# Altium schematic sheet PCB_Guardian.SchDoc
size A4
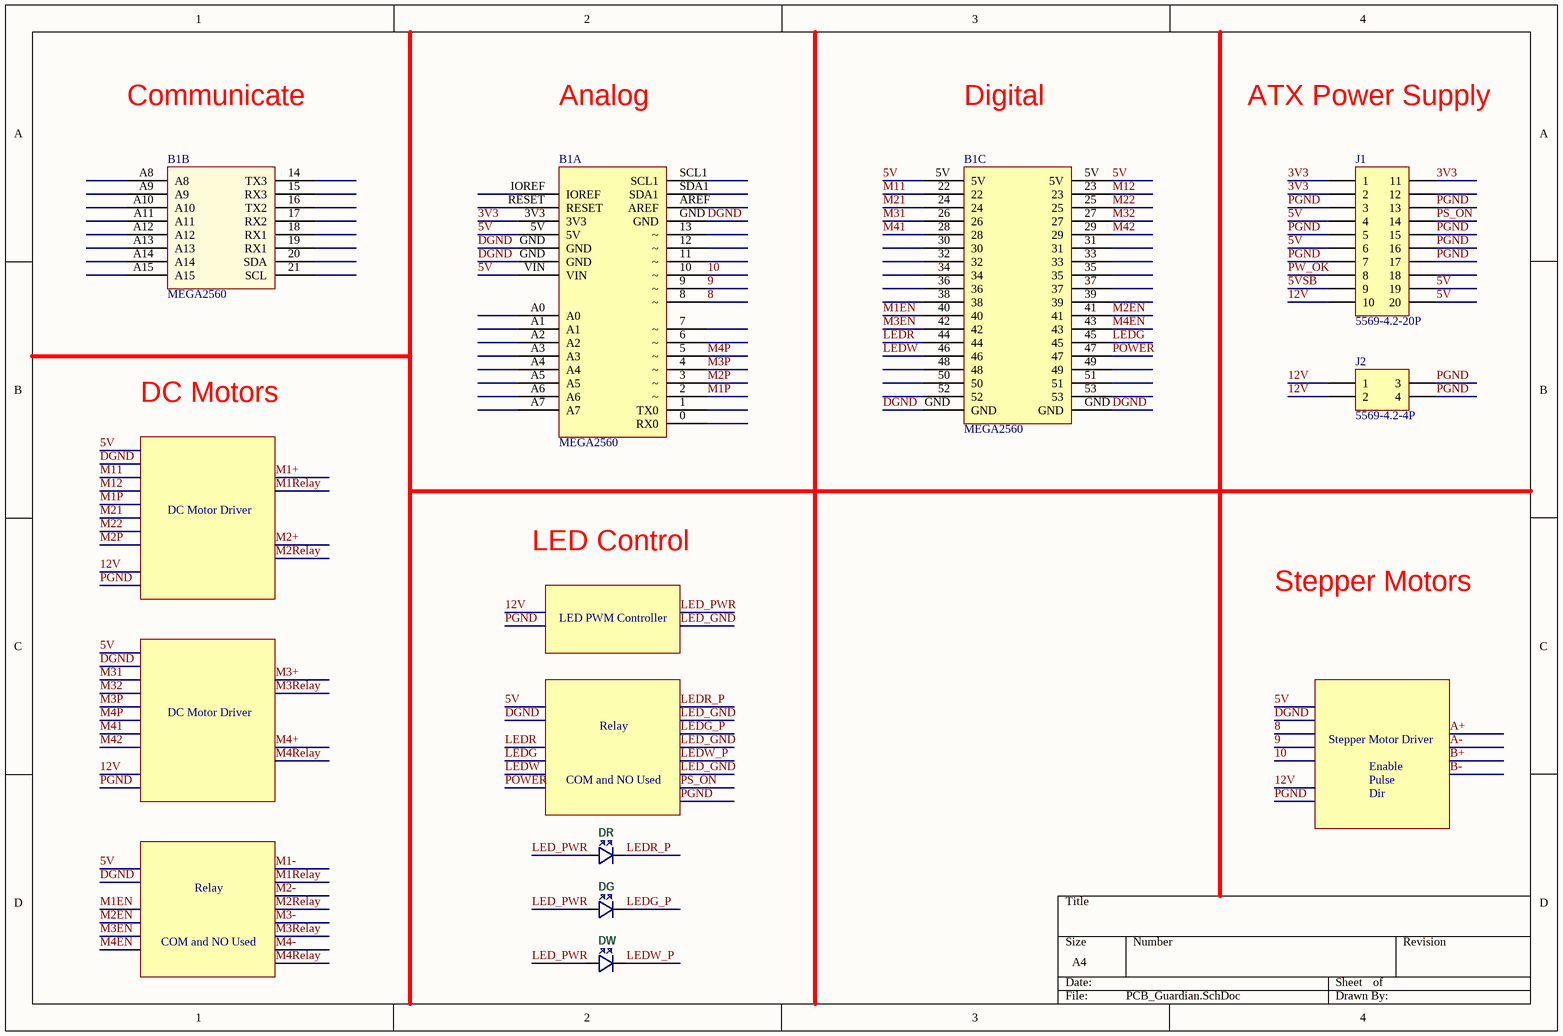
[diagram p0: PCB_Guardian.SchDoc]

## Parts
B1  MEGA2560  [Arduino MEGA2560 Center Mount Holes]  (parts A,B,C of 3)
DG  (no value)
DR  (no value)
DW  (no value)
J1  5569-4.2-20P  [5569_2*10P_CEN_H_4.2]
J2  5569-4.2-4P  [5569_2*2P_CEN_H_4.2]

## Nets
3V3: B1.3V3 J1.1 J1.2 J1.11
5V: B1.5V B1.VIN J1.4 J1.6 J1.19 J1.20
5VSB: J1.9
8: B1.8
9: B1.9
10: B1.10
12V: J1.10 J2.1 J2.2
DGND: B1.GND
LED_PWR: DG.A DR.A DW.A
LEDG: B1.45
LEDG_P: DG.K
LEDR: B1.44
LEDR_P: DR.K
LEDW: B1.46
LEDW_P: DW.K
M1EN: B1.40
M1P: B1.2
M2EN: B1.41
M2P: B1.3
M3EN: B1.42
M3P: B1.4
M4EN: B1.43
M4P: B1.5
M11: B1.22
M12: B1.23
M21: B1.24
M22: B1.25
M31: B1.26
M32: B1.27
M41: B1.28
M42: B1.29
PGND: J1.3 J1.5 J1.7 J1.13 J1.15 J1.16 J1.17 J2.3 J2.4
POWER: B1.47
PS_ON: J1.14
PW_OK: J1.8

Not connected (* = marked no-connect by the designer): B1 0(RX0) 1(TX0) 6(~) 7(~) 11(~) 12(~) 13(~) 14(TX3) 15(RX3) 16(TX2) 17(RX2) 18(RX1) 19(RX1) 20(SDA) 21(SCL) 30 31 32 33 34 35 36 37 38 39 48 49 50 51 52 53 A0 A1 A2 A3 A4 A5 A6 A7 A8 A9 A10 A11 A12 A13 A14 A15 AREF IOREF RESET SCL1 SDA1; J1 12 18

## Notes on the sheet
- Communicate
- Analog
- Digital
- ATX Power Supply
- DC Motors
- DC Motor Driver
- LED Control
- LED PWM Controller
- Stepper Motors
- COM and NO Used
- Relay
- Stepper Motor Driver
- Enable
- Pulse
- Dir

## Library data of the parts
B1 = Arduino
DG DR DW = LED: =Description
J1 = 5569-4.2-20P 弯脚: 5557/5569母座; SuppliersPartNumber: *; Manufacturer: *; ComponentLink1URL: https://detail.tmall.com/item.htm?spm=a1z10.3-b.w4011-14865995301.22.njlsYj&id=523296744641&rn=eedbbec3ad968f3b9987a5aa938ba03c&abbucket=9; ComponentLink1Description: 供应商链接; price: 1.08; Supplier: Farpu
J2 = 5569-4.2-4P 弯脚: 5557/5569母座; SuppliersPartNumber: *; Manufacturer: *; ComponentLink1URL: https://detail.tmall.com/item.htm?spm=a1z10.3-b.w4011-14865995301.22.njlsYj&id=523296744641&rn=eedbbec3ad968f3b9987a5aa938ba03c&abbucket=9; ComponentLink1Description: 供应商链接; price: 0.25; Supplier: Farpu